# Altium project Pi Interface PCB.PrjPcb
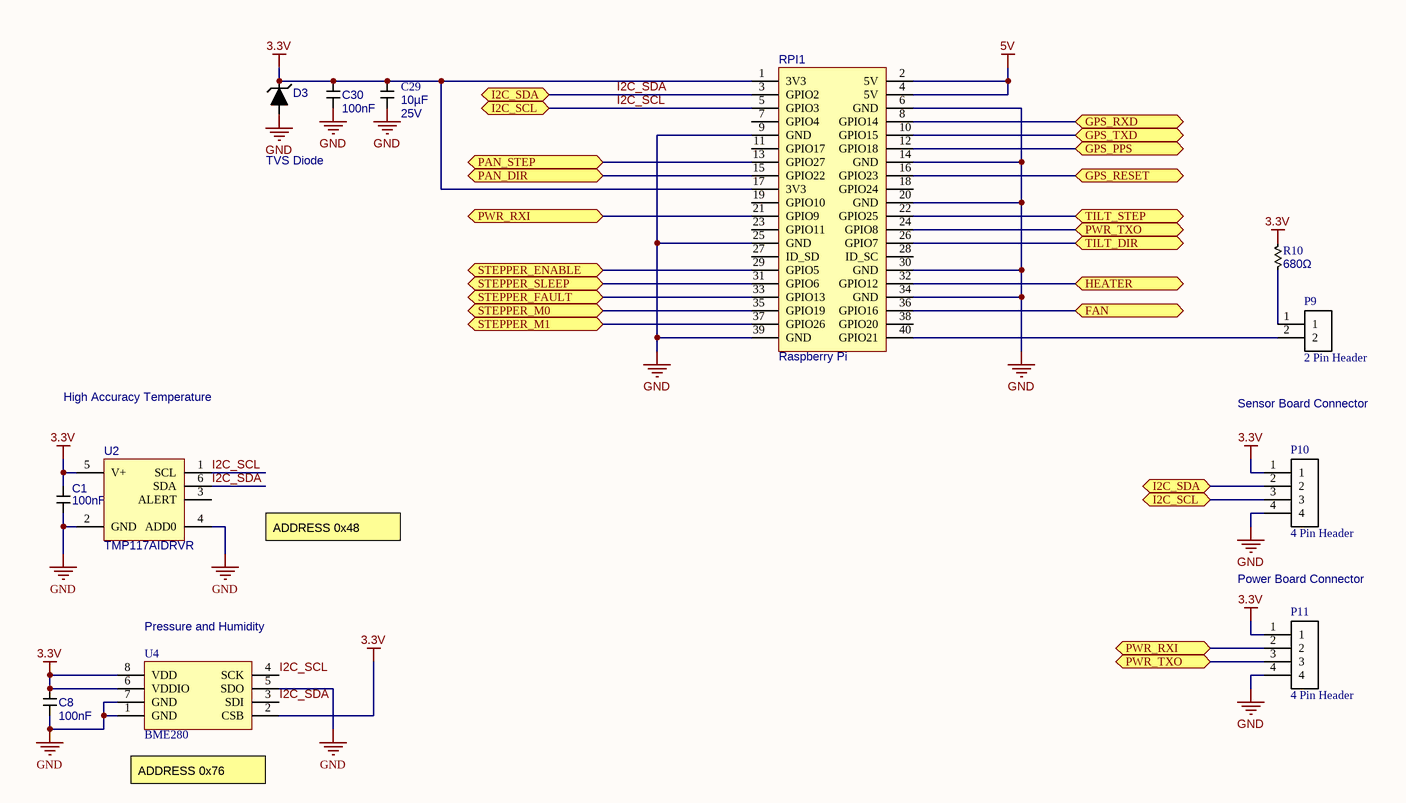
[diagram p0: Raspberry Pi Interface.SchDoc]
5 sheets, 73 parts. Net scope: flat (ports and power ports of the same name join across sheets).
Sheets:
  Raspberry Pi Interface.SchDoc
  Power Supply.SchDoc
  Electronics Heater.SchDoc
  GPS Receiver.SchDoc
  Pan & Tilt Stepper Control.SchDoc

## Sheet Raspberry Pi Interface.SchDoc
size A3

### Parts
(Parts that share a designator on the sheet are numbered #1, #2 ... from top to bottom, then left to right.)
?#1  (no value)
C1  100nF  [C0805]
C8  100nF  [C0805]
C29  Voltage Rating: 25V  Capacitance: 10µF  [C0805]  (hidden comment: F)
C30  100nF  [C0805]
D3  TVS Diode  [SP4020-01FTG-C]
P9  2 Pin Header  [S2B-XH-A(LF)(SN)]
P10  4 Pin Header  [B4B-XH-A]
P11  4 Pin Header  [B4B-XH-A]
R10  680Ω  [R0805]
RPI1  Raspberry Pi  [Raspberry Pi 4B]
U2  TMP117AIDRVR  [TMP117AIDRVR]
U4  BME280  [BME280]

### Ports
FAN, GPS_PPS, GPS_RESET, GPS_RXD, GPS_TXD, HEATER, I2C_SCL, I2C_SDA, PAN_DIR, PAN_STEP, PWR_RXI, PWR_TXO, STEPPER_ENABLE, STEPPER_FAULT, STEPPER_M0, STEPPER_M1, STEPPER_SLEEP, TILT_DIR, TILT_STEP

### Nets
3.3V: C1.1 C8.1 C29.1 C30.1 D3.1 P10.1 P11.1 R10.2 RPI1.1(3V3) RPI1.17(3V3) U2.5(V+) U4.2(CSB) U4.6(VDDIO) U4.8(VDD)
5V: RPI1.2(5V) RPI1.4(5V)
GND: C1.2 C8.2 C29.2 C30.2 D3.2 P10.4 P11.4 RPI1.6(GND) RPI1.9(GND) RPI1.14(GND) RPI1.20(GND) RPI1.25(GND) RPI1.30(GND) RPI1.34(GND) RPI1.39(GND) U2.2(GND) U2.4(ADD0) U4.1(GND) U4.5(SDO) U4.7(GND)
I2C_SCL: P10.3 RPI1.5(GPIO3) U2.1(SCL) U4.4(SCK) ; port I2C_SCL
I2C_SDA: P10.2 RPI1.3(GPIO2) U2.6(SDA) U4.3(SDI) ; port I2C_SDA
P-DIR: RPI1.15(GPIO22) ; port PAN_DIR
P-ENBL: RPI1.29(GPIO5) ; port STEPPER_ENABLE
P-STEP: RPI1.13(GPIO27) ; port PAN_STEP
NetGPS1_7: RPI1.12(GPIO18) ; port GPS_PPS
NetGPS1_13: RPI1.10(GPIO15) ; port GPS_TXD
NetGPS1_14: RPI1.8(GPIO14) ; port GPS_RXD
NetGPS1_18: RPI1.16(GPIO23) ; port GPS_RESET
NetP9_1: P9.1 R10.1
NetP9_2: P9.2 RPI1.40(GPIO21)
NetP11_2: P11.2 RPI1.21(GPIO9) ; port PWR_RXI
NetP11_3: P11.3 RPI1.24(GPIO8) ; port PWR_TXO
NetQ1_1: RPI1.32(GPIO12) ; port HEATER
NetQ2_1: RPI1.36(GPIO16) ; port FAN
NetRPI1_22: RPI1.22(GPIO25) ; port TILT_STEP
NetRPI1_26: RPI1.26(GPIO7) ; port TILT_DIR
NetRPI1_31: RPI1.31(GPIO6) ; port STEPPER_SLEEP
NetRPI1_33: RPI1.33(GPIO13) ; port STEPPER_FAULT
NetRPI1_35: RPI1.35(GPIO19) ; port STEPPER_M0
NetRPI1_37: RPI1.37(GPIO26) ; port STEPPER_M1

Not connected (* = marked no-connect by the designer): RPI1 7(GPIO4) 11(GPIO17) 18(GPIO24) 19(GPIO10) 23(GPIO11) 27(ID_SD) 28(ID_SC) 38(GPIO20); U2 3(ALERT)

### Notes on the sheet
- High Accuracy Temperature
- Sensor Board Connector
- ADDRESS 0x48
- Power Board Connector
- (near U4) Pressure and Humidity
- (near U4) ADDRESS 0x76
- DRAWN BY
- CHECKED BY
- DATE
- TITLE
- Title
- Size:
- Date:
- A3
- Number:
- Time:
- Revision:
- Sheet
- of
- APPROVED BY
- RELEASED BY
- SCALE:
- SIZE
- DRAWING NUMBER
- SHEET
- -
- OF
- File:

### Library data of the parts
?#1 = Title Block
C1 C8 C30 = Capacitor: Manufacturer: YAGEO; Manufacturer Part Number: CC0805KRX7R9BB104; Tolerance: ±10%; Temperature Coefficient: X7R; Voltage Rating: 50V; Supplier: Digi-Key Electronics; Supplier Part Number: 311-1140-1-ND; Capacitance: 100nF
C29 = Capacitor: Manufacturer: Samsung Electro-Mechanics; Manufacturer Part Number: CL21A106KAYNNNG; Supplier: Digi-Key Electronics; Supplier Part Number: 1276-6454-1-ND; Price: 0.28
D3 = Diode TVS: Manufacturer: Littelfuse Inc.; Supplier: Digi-Key Electronics; Supplier Part Number: F6271CT-ND; Manufacturer Part Number: SP4020-01FTG-C
P9 = Header 2: Manufacturer: JST Sales America Inc.; Manufacturer Part Number: S2B-XH-A; Supplier: Digi-Key Electronics; Supplier Part Number: 455-S2B-XH-A-ND
P10 P11 = Header 4: Manufacturer: JST; Manufacturer Part Number: B4B-XH-2; Supplier: Digi-Key Electronics; Supplier Part Number: 455-B4B-XH-A-ND
R10 = Resistor: Standard Resistor; Manufacturer: Panasonic Electronic Components; Manufacturer Part Number: ERJ-6GEYJ681V; Power Rating: 1/8W; Supplier: Digi-Key Electronics; Supplier Part Number: P680ACT-ND; Price: 0.16; Resistance: 680Ω
RPI1 = Raspberry Pi 40 Pin Header: Manufacturer Part Number: PPTC202LFBN-RC; Manufacturer: Sullins Connector Solutions; Current Rating: 3A; Supplier: Digi-Key Electronics; Supplier Part Number: S6104-ND; Price: $2.60; Operating Temperature: -40°C ~ 105°C
U2 = TMP117AIDRVR: Temperature Sensor Digital, Local -55°C ~ 150°C 16 b 6-WSON (2x2); Manufacturer: Texas Instruments; Manufacturer Part Number: TMP117AIDRVR; Supplier: Digi-Key Electronics; Supplier Part Number: 296-51834-1-ND
U4 = BME280: Pressure and Humidity Sensor; Manufacturer: Bosch Sensortec; Supplier: Digi-Key Electronics; Supplier Part Number: 828-1063-1-ND; Manufacturer Part Number: BME280

## Sheet Power Supply.SchDoc
size A3
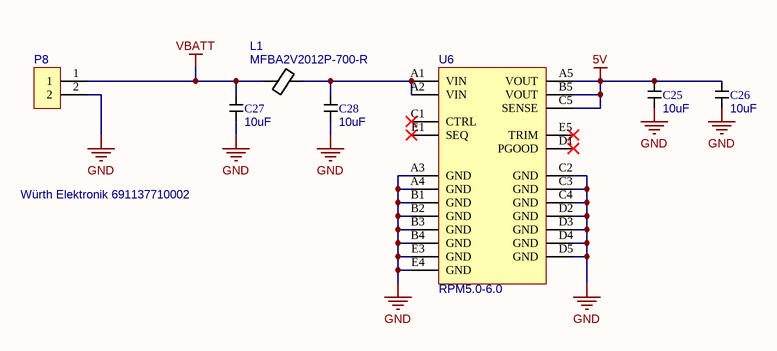
[diagram p1: Power Supply.SchDoc]

### Parts
(Parts that share a designator on the sheet are numbered #1, #2 ... from top to bottom, then left to right.)
?#2  (no value)
C25  Capacitance: 10uF  [C0805]  (hidden comment: F)
C26  Capacitance: 10uF  [C0805]  (hidden comment: F)
C27  Capacitance: 10uF  [C0805]  (hidden comment: F)
C28  Capacitance: 10uF  [C0805]  (hidden comment: F)
L1  MFBA2V2012P-700-R  [0805]
P8  Würth Elektronik 691137710002  [Würth Elektronik 691137710002]
U6  RPM5.0-6.0  [RPM5.0-6.0]

### Nets
5V: C25.1 C26.1 U6.A5(VOUT) U6.B5(VOUT) U6.C5(SENSE)
GND: C25.2 C26.2 C27.2 C28.2 P8.2 U6.A3(GND) U6.A4(GND) U6.B1(GND) U6.B2(GND) U6.B3(GND) U6.B4(GND) U6.C2(GND) U6.C3(GND) U6.C4(GND) U6.D2(GND) U6.D3(GND) U6.D4(GND) U6.D5(GND) U6.E3(GND) U6.E4(GND)
VBATT: C27.1 L1.1 P8.1
NetC28_1: C28.1 L1.2 U6.A1(VIN) U6.A2(VIN)

Not connected (* = marked no-connect by the designer): U6 C1(CTRL)* D1(PGOOD)* E1(SEQ)* E5(TRIM)*

### Notes on the sheet
- DRAWN BY
- CHECKED BY
- DATE
- TITLE
- Title
- Size:
- Date:
- A3
- Number:
- Time:
- Revision:
- Sheet
- of
- APPROVED BY
- RELEASED BY
- SCALE:
- SIZE
- DRAWING NUMBER
- SHEET
- -
- OF
- File:

### Library data of the parts
?#2 = Title Block
C25-C28 = Capacitor: Manufacturer: Murata Electronics; Manufacturer Part Number: GRM21BZ71E106KE15L; Voltage Rating: 25V; Supplier: Digi-Key Electronics; Supplier Part Number: 490-GRM21BZ71E106KE15LCT-ND; Price: 0.03
L1 = Ferrite Bead: Manufacturer: Eaton - Electronics Division; Impedance @ Frequency: 70 Ohms @ 100 MHz; Current Rating: 6A; Supplier: Digi-Key Electronics; Supplier Part Number: 283-MFBA2V2012P-700-RCT-ND; Manufacturer Part Number: MFBA2V2012P-700-R
P8 = Würth Elektronik 691137710002: 2 Position Wire to Board Terminal Block Horizontal with Board 0.197" (5.00mm) Through Hole; Positions: 2; Voltage Rating: 300V; Current Rating: 16A; Wire Gauge: 12-30AWG; Manufacturer: Würth Elektronik; Manufacturer Part Number: 691137710002; Supplier: Digi-Key Electronics; Supplier Part Number: 732-10955-ND
U6 = RPM5.0-6.0: Non-Isolated PoL Module DC DC Converter 1 Output 5V 6A 4V - 15V Input; Manufacturer: Recom Power; Voltage Input: 4 - 15V; Supplier: Digi-Key Electronics; Supplier Part Number: 945-RPM5.0-6.0CT-ND; Manufacturer Part Number: RPM5.0-6.0; Output Voltage: 5V; Output Current: 6A

## Sheet Electronics Heater.SchDoc
size A3
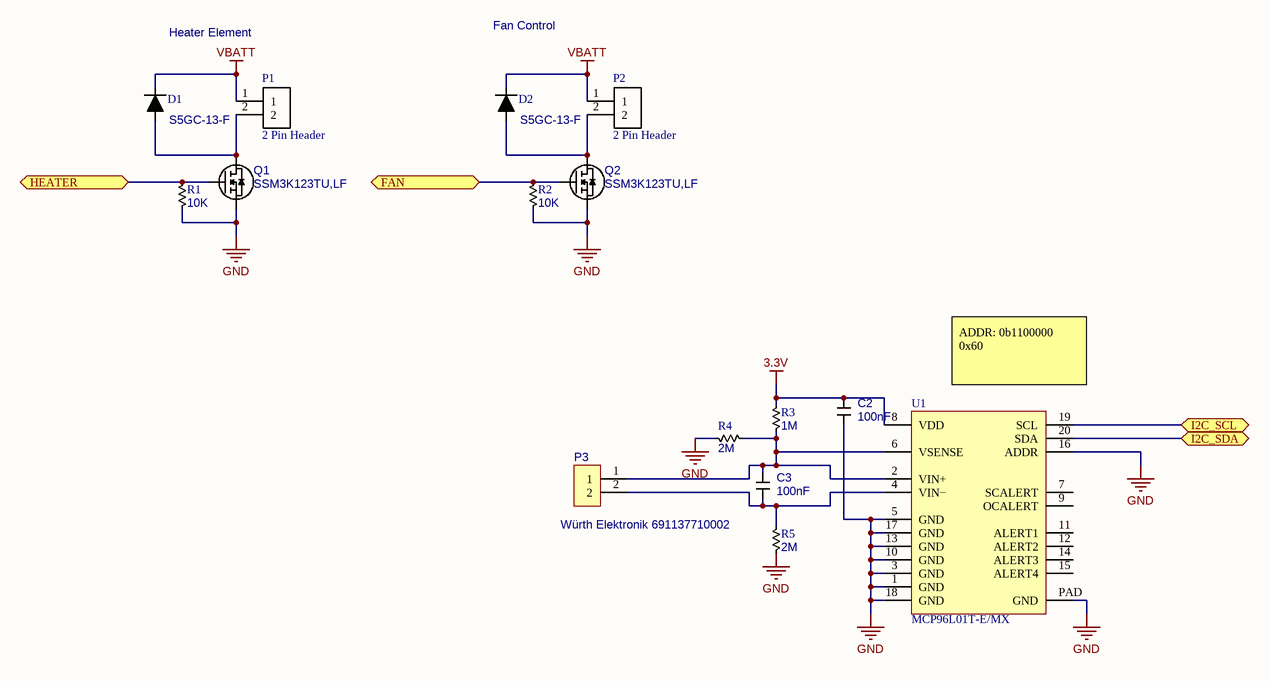
[diagram p2: Electronics Heater.SchDoc]

### Parts
(Parts that share a designator on the sheet are numbered #1, #2 ... from top to bottom, then left to right.)
?#3  (no value)
C2  100nF  [C0805]
C3  100nF  [C0805]
D1  S5GC-13-F  [SMC]
D2  S5GC-13-F  [SMC]
P1  2 Pin Header  [S2B-XH-A(LF)(SN)]
P2  2 Pin Header  [S2B-XH-A(LF)(SN)]
P3  Würth Elektronik 691137710002  [Würth Elektronik 691137710002]
Q1  SSM3K123TU,LF  [SSM3K123TU,LF]
Q2  SSM3K123TU,LF  [SSM3K123TU,LF]
R1  Resistance: 10K  [R0805]  (hidden comment: 330Ω)
R2  Resistance: 10K  [R0805]  (hidden comment: 330Ω)
R3  Resistance: 1M  [R0805]  (hidden comment: 330Ω)
R4  Resistance: 2M  [R0805]  (hidden comment: 330Ω)
R5  Resistance: 2M  [R0805]  (hidden comment: 330Ω)
U1  MCP96L01T-E/MX  [MCP96L01T-E/MX]

### Ports
FAN, HEATER, I2C_SCL, I2C_SDA

### Nets
3.3V: C2.1 R3.2 U1.8(VDD)
GND: C2.2 Q1.2 Q2.2 R1.1 R2.1 R4.2 R5.2 U1.1(GND) U1.3(GND) U1.5(GND) U1.10(GND) U1.13(GND) U1.16(ADDR) U1.17(GND) U1.18(GND) U1.PAD(GND)
VBATT: D1.1 D2.1 P1.1 P2.1
I2C_SCL: U1.19(SCL) ; port I2C_SCL
I2C_SDA: U1.20(SDA) ; port I2C_SDA
NetC3_1: C3.1 P3.1 R3.1 R4.1 U1.2(VIN+) U1.6(VSENSE)
NetC3_2: C3.2 P3.2 R5.1 U1.4(VIN−)
NetD1_2: D1.2 P1.2 Q1.3
NetD2_2: D2.2 P2.2 Q2.3
NetQ1_1: Q1.1 R1.2 ; port HEATER
NetQ2_1: Q2.1 R2.2 ; port FAN

Not connected (* = marked no-connect by the designer): U1 7(SCALERT) 9(OCALERT) 11(ALERT1) 12(ALERT2) 14(ALERT3) 15(ALERT4)

### Notes on the sheet
- Heater Element
- Fan Control
- (near U1) ADDR: 0b1100000
  0x60
- DRAWN BY
- CHECKED BY
- DATE
- TITLE
- Title
- Size:
- Date:
- A3
- Number:
- Time:
- Revision:
- Sheet
- of
- APPROVED BY
- RELEASED BY
- SCALE:
- SIZE
- DRAWING NUMBER
- SHEET
- -
- OF
- File:

### Library data of the parts
?#3 = Title Block
C2 C3 = Capacitor: as C1 on sheet Raspberry Pi Interface; Supplier: Digi-Key Electronics; Supplier Part Number: 311-1140-1-ND; Capacitance: 100nF
D1 D2 = Diode: Manufacturer: Diodes Incorporated; Current Rating: 5A; Voltage: 400V; Supplier: Digi-Key Electronics; Supplier Part Number: S5GC-FDICT-ND; Manufacturer Part Number: S5GC-13-F
P1 P2 = Header 2: as P9 on sheet Raspberry Pi Interface; Supplier: Digi-Key Electronics; Supplier Part Number: 455-S2B-XH-A-ND
P3 = Würth Elektronik 691137710002: as P8 on sheet Power Supply; Manufacturer: Würth Elektronik; Manufacturer Part Number: 691137710002; Supplier: Digi-Key Electronics; Supplier Part Number: 732-10955-ND
Q1 Q2 = SSM3K123TU,LF: N-Channel 20 V 4.2A (Ta) 500mW (Ta) Surface Mount UFM; Manufacturer: Toshiba Semiconductor and Storage; Supplier: Digi-Key Electronics; Supplier Part Number: SSM3K123TULFCT-ND; Manufacturer Part Number: SSM3K123TU,LF
R1 R2 = Resistor: Standard Resistor; Manufacturer: YAGEO; Manufacturer Part Number: RC0805JR-0710KL; Power Rating: 1/8W; Supplier: Digi-Key Electronics; Supplier Part Number: 311-10KARCT-ND; Price: 0.16
R3 = Resistor: Standard Resistor; Manufacturer: Panasonic Electronic Components; Manufacturer Part Number: ERA-6AEB105V; Power Rating: 1/8W; Supplier: Digi-Key Electronics; Supplier Part Number: P1MDACT-ND; Price: 0.16
R4 R5 = Resistor: Standard Resistor; Manufacturer: Vishay Dale; Manufacturer Part Number: CRCW08052M00FKECC; Power Rating: 1/8W; Supplier: Digi-Key Electronics; Supplier Part Number: 541-4129-1-ND; Price: 0.16
U1 = MCP96L01T-E/MX: Thermocouple EMF to Temperature Converter,  ±1.5°C Maximum Accuracy; Manufacturer: Microchip Technology; Supplier: Digi-Key Electronics; Manufacturer Part Number: MCP96L01T-E/MX; Supplier Part Number: 150-MCP96L01T-E/MXCT-ND

## Sheet GPS Receiver.SchDoc
size A3
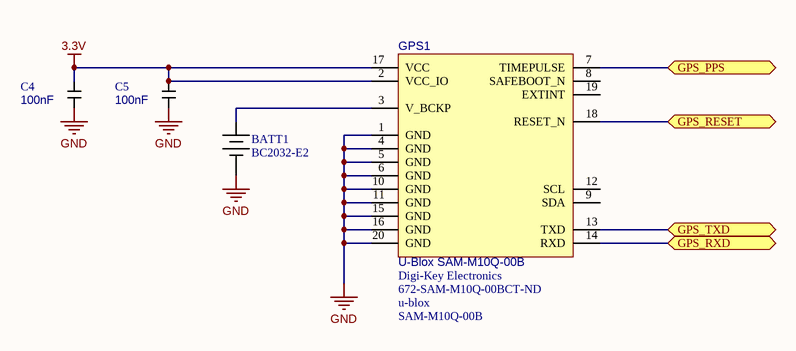
[diagram p3: GPS Receiver.SchDoc]

### Parts
(Parts that share a designator on the sheet are numbered #1, #2 ... from top to bottom, then left to right.)
?#4  (no value)
BATT1  BC2032-E2  [BC2032-E2]
C4  Capacitance: 100nF  [C0805]  (hidden comment: F)
C5  Capacitance: 100nF  [C0805]  (hidden comment: F)
GPS1  U-Blox SAM-M10Q-00B  Supplier: Digi-Key Electronics  Supplier Part Number: 672-SAM-M10Q-00BCT-ND  Manufacturer: u-blox  Manufacturer Part Number: SAM-M10Q-00B  [U-BLOX SAM-M10Q-00B]

### Ports
GPS_PPS, GPS_RESET, GPS_RXD, GPS_TXD

### Nets
3.3V: C4.1 C5.1 GPS1.2(VCC_IO) GPS1.17(VCC)
GND: BATT1.2 C4.2 C5.2 GPS1.1(GND) GPS1.4(GND) GPS1.5(GND) GPS1.6(GND) GPS1.10(GND) GPS1.11(GND) GPS1.15(GND) GPS1.16(GND) GPS1.20(GND)
NetBATT1_1: BATT1.1 GPS1.3(V_BCKP)
NetGPS1_7: GPS1.7(TIMEPULSE) ; port GPS_PPS
NetGPS1_13: GPS1.13(TXD) ; port GPS_TXD
NetGPS1_14: GPS1.14(RXD) ; port GPS_RXD
NetGPS1_18: GPS1.18(RESET_N) ; port GPS_RESET

Not connected (* = marked no-connect by the designer): GPS1 8(SAFEBOOT_N) 9(SDA) 12(SCL) 19(EXTINT)

### Notes on the sheet
- DRAWN BY
- CHECKED BY
- DATE
- TITLE
- Title
- Size:
- Date:
- A3
- Number:
- Time:
- Revision:
- Sheet
- of
- APPROVED BY
- RELEASED BY
- SCALE:
- SIZE
- DRAWING NUMBER
- SHEET
- -
- OF
- File:

### Library data of the parts
?#4 = Title Block
BATT1 = BC2032-E2: Battery; Manufacturer: MPD (Memory Protection Devices); Manufacturer Part Number: BC2032-E2; Supplier Part Number: BC2032-E2-ND; Supplier: Digi-Key Electronics
C4 C5 = Capacitor: Manufacturer: Samsung Electro-Mechanics; Manufacturer Part Number: CL21B104KBCNNNC; Voltage Rating: 50V; Supplier: Digi-Key Electronics; Supplier Part Number: 1276-1003-1-ND; Price: 0.16
GPS1 = U-Blox SAM-M10Q-00B: GPS with integrated Antenna

## Sheet Pan & Tilt Stepper Control.SchDoc
size A3
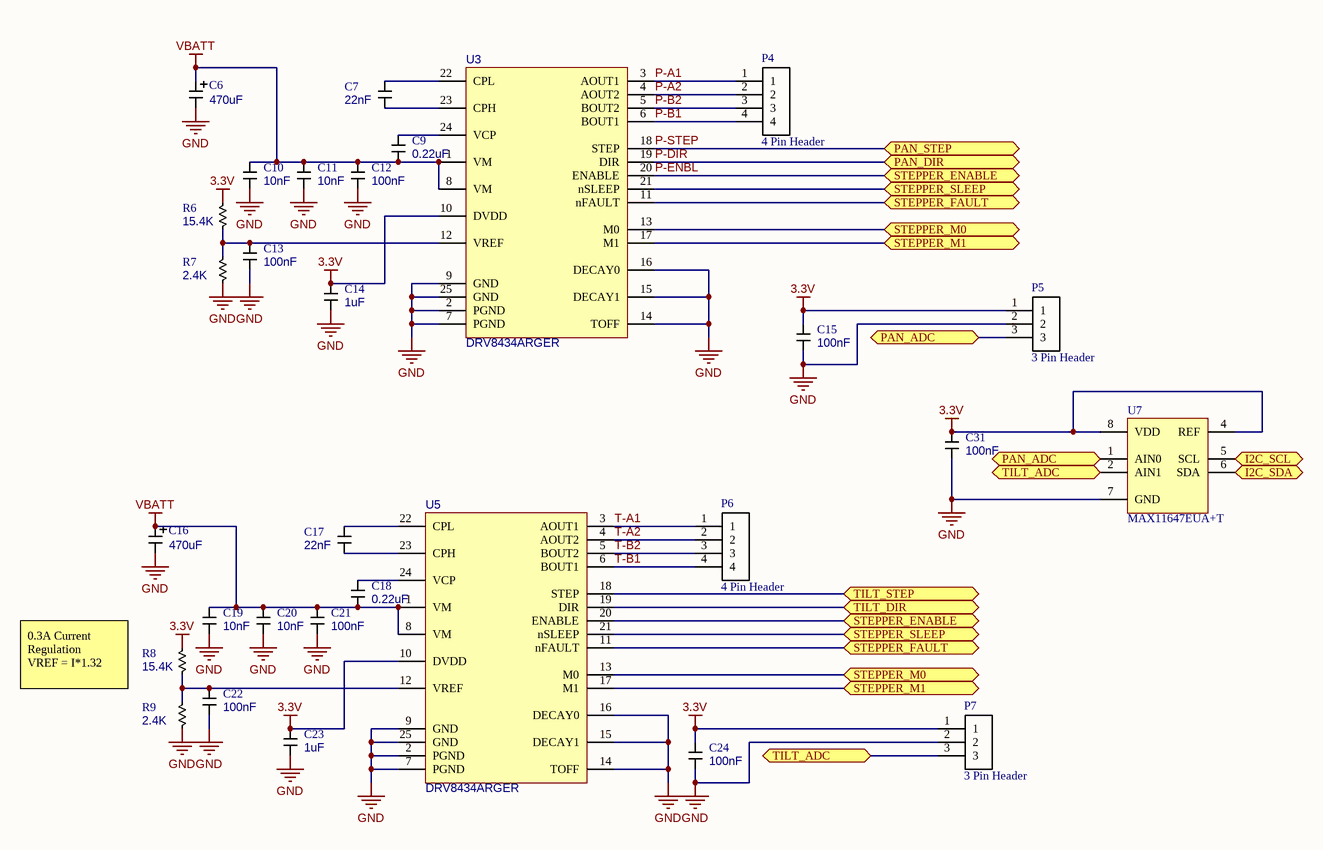
[diagram p4: Pan & Tilt Stepper Control.SchDoc]

### Parts
(Parts that share a designator on the sheet are numbered #1, #2 ... from top to bottom, then left to right.)
?#5  (no value)
C6  Capacitance: 470uF  [Panasonic EEE-FT1E471AP]  (hidden comment: F)
C7  Capacitance: 22nF  [C0805]  (hidden comment: F)
C9  Capacitance: 0.22uF  [C0805]  (hidden comment: F)
C10  Capacitance: 10nF  [C0805]  (hidden comment: F)
C11  Capacitance: 10nF  [C0805]  (hidden comment: F)
C12  Capacitance: 100nF  [C0805]  (hidden comment: F)
C13  Capacitance: 100nF  [C0805]  (hidden comment: F)
C14  Capacitance: 1uF  [C0805]  (hidden comment: F)
C15  Capacitance: 100nF  [C0805]  (hidden comment: F)
C16  Capacitance: 470uF  [Panasonic EEE-FT1E471AP]  (hidden comment: F)
C17  Capacitance: 22nF  [C0805]  (hidden comment: F)
C18  Capacitance: 0.22uF  [C0805]  (hidden comment: F)
C19  Capacitance: 10nF  [C0805]  (hidden comment: F)
C20  Capacitance: 10nF  [C0805]  (hidden comment: F)
C21  Capacitance: 100nF  [C0805]  (hidden comment: F)
C22  Capacitance: 100nF  [C0805]  (hidden comment: F)
C23  Capacitance: 1uF  [C0805]  (hidden comment: F)
C24  Capacitance: 100nF  [C0805]  (hidden comment: F)
C31  Capacitance: 100nF  [C0805]  (hidden comment: F)
P4  4 Pin Header  [B4B-XH-A]
P5  3 Pin Header  [B3B-XH-A]
P6  4 Pin Header  [B4B-XH-A]
P7  3 Pin Header  [B3B-XH-A]
R6  Resistance: 15.4K  [R0805]  (hidden comment: 330Ω)
R7  Resistance: 2.4K  [R0805]  (hidden comment: 330Ω)
R8  Resistance: 15.4K  [R0805]  (hidden comment: 330Ω)
R9  Resistance: 2.4K  [R0805]  (hidden comment: 330Ω)
U3  DRV8434ARGER  [DRV8434ARGER]
U5  DRV8434ARGER  [DRV8434ARGER]
U7  MAX11647EUA+T  [MAX11647EUA+T]

### Ports
I2C_SCL, I2C_SDA, PAN_ADC, PAN_DIR, PAN_STEP, STEPPER_ENABLE, STEPPER_FAULT, STEPPER_M0, STEPPER_M1, STEPPER_SLEEP, TILT_ADC, TILT_DIR, TILT_STEP

### Nets
3.3V: C14.1 C15.1 C23.1 C24.1 C31.1 P5.1 P7.1 R6.2 R8.2 U3.10(DVDD) U5.10(DVDD) U7.4(REF) U7.8(VDD)
GND: C6.2 C10.2 C11.2 C12.2 C13.2 C14.2 C15.2 C16.2 C19.2 C20.2 C21.2 C22.2 C23.2 C24.2 C31.2 P5.2 P7.2 R7.1 R9.1 U3.2(PGND) U3.7(PGND) U3.9(GND) U3.14(TOFF) U3.15(DECAY1) U3.16(DECAY0) U3.25(GND) U5.2(PGND) U5.7(PGND) U5.9(GND) U5.14(TOFF) U5.15(DECAY1) U5.16(DECAY0) U5.25(GND) U7.7(GND)
VBATT: C6.1 C9.2 C10.1 C11.1 C12.1 C16.1 C18.2 C19.1 C20.1 C21.1 U3.1(VM) U3.8(VM) U5.1(VM) U5.8(VM)
I2C_SCL: U7.5(SCL) ; port I2C_SCL
I2C_SDA: U7.6(SDA) ; port I2C_SDA
P-A1: P4.1 U3.3(AOUT1)
P-A2: P4.2 U3.4(AOUT2)
P-B1: P4.4 U3.6(BOUT1)
P-B2: P4.3 U3.5(BOUT2)
P-DIR: U3.19(DIR) ; port PAN_DIR
P-ENBL: U3.20(ENABLE) U5.20(ENABLE) ; port STEPPER_ENABLE
P-STEP: U3.18(STEP) ; port PAN_STEP
T-A1: P6.1 U5.3(AOUT1)
T-A2: P6.2 U5.4(AOUT2)
T-B1: P6.4 U5.6(BOUT1)
T-B2: P6.3 U5.5(BOUT2)
NetC7_1: C7.1 U3.22(CPL)
NetC7_2: C7.2 U3.23(CPH)
NetC9_1: C9.1 U3.24(VCP)
NetC13_1: C13.1 R6.1 R7.2 U3.12(VREF)
NetC17_1: C17.1 U5.22(CPL)
NetC17_2: C17.2 U5.23(CPH)
NetC18_1: C18.1 U5.24(VCP)
NetC22_1: C22.1 R8.1 R9.2 U5.12(VREF)
NetP5_3: P5.3 U7.1(AIN0) ; port PAN_ADC
NetP7_3: P7.3 U7.2(AIN1) ; port TILT_ADC
NetRPI1_22: U5.18(STEP) ; port TILT_STEP
NetRPI1_26: U5.19(DIR) ; port TILT_DIR
NetRPI1_31: U3.21(nSLEEP) U5.21(nSLEEP) ; port STEPPER_SLEEP
NetRPI1_33: U3.11(nFAULT) U5.11(nFAULT) ; port STEPPER_FAULT
NetRPI1_35: U3.13(M0) U5.13(M0) ; port STEPPER_M0
NetRPI1_37: U3.17(M1) U5.17(M1) ; port STEPPER_M1

### Notes on the sheet
- 0.3A Current Regulation
  VREF = I*1.32
- DRAWN BY
- CHECKED BY
- DATE
- TITLE
- Title
- Size:
- Date:
- A3
- Number:
- Time:
- Revision:
- Sheet
- of
- APPROVED BY
- RELEASED BY
- SCALE:
- SIZE
- DRAWING NUMBER
- SHEET
- -
- OF
- File:

### Library data of the parts
?#5 = Title Block
C6 C16 = Capacitor Polarized: Polarized Capacitor; Manufacturer: Panasonic Electronic Components; Manufacturer Part Number: EEE-FT1E471AP; Voltage Rating: 25V; Supplier: Digi-Key Electronics; Supplier Part Number: PCE5010CT-ND
C7 C17 = Capacitor: Manufacturer: TDK Corporation; Manufacturer Part Number: CGA4J3X7R2E223K125AA; Voltage Rating: 250V; Supplier: Digi-Key Electronics; Supplier Part Number: 445-5836-1-ND; Price: 0.16
C9 C18 = Capacitor: Manufacturer: KEMET; Manufacturer Part Number: C0805C224K5RAC7800; Voltage Rating: 50V; Supplier: Digi-Key Electronics; Supplier Part Number: 399-C0805C224K5RACTUCT-ND; Price: 0.24
C10 C11 C19 C20 = Capacitor: Manufacturer: YAGEO; Manufacturer Part Number: CC0805KRX7R9BB103; Voltage Rating: 50V; Supplier: Digi-Key Electronics; Supplier Part Number: 311-1136-1-ND; Price: 0.16
C12 C13 C15 C21 C22 C24 C31 = Capacitor: as C4 on sheet GPS Receiver; Supplier: Digi-Key Electronics; Supplier Part Number: 1276-1003-1-ND; Price: 0.16
C14 C23 = Capacitor: Manufacturer: Samsung Electro-Mechanics; Manufacturer Part Number: CL21B105KAFNNNE; Voltage Rating: 25V; Supplier: Digi-Key Electronics; Supplier Part Number: 1276-1066-1-ND; Price: 0.16
P4 P6 = Header 4: as P10 on sheet Raspberry Pi Interface; Supplier: Digi-Key Electronics; Supplier Part Number: 455-B4B-XH-A-ND
P5 P7 = Header 3: Manufacturer: JST Sales America Inc.; Supplier: Digi-Key Electronics; Supplier Part Number: 455-2248-ND; Manufacturer Part Number: B3B-XH-A
R6 R8 = Resistor: Standard Resistor; Manufacturer: Vishay Dale; Manufacturer Part Number: CRCW080515K4FKEA; Power Rating: 1/8W; Supplier: Digi-Key Electronics; Supplier Part Number: 541-15.4KCCT-ND; Price: 0.16
R7 R9 = Resistor: Standard Resistor; Manufacturer: Vishay Dale; Manufacturer Part Number: CRCW08052K10FKEA; Power Rating: 1/8W; Supplier: Digi-Key Electronics; Supplier Part Number: 541-2.10KCCT-ND; Price: 0.16
U3 U5 = DRV8434ARGER: Bipolar Motor Driver NMOS Step/Direction 24-VQFN (4x4); Manufacturer: Texas Instruments; Supplier: Digi-Key Electronics; Supplier Part Number: 296-DRV8434ARGERCT-ND; Manufacturer Part Number: DRV8434ARGER
U7 = MAX11647EUA+T: 10 Bit Analog to Digital Converter 1, 2 Input 1 SAR 8-uMAX/uSOP; Manufacturer: Analog Devices Inc./Maxim Integrated; Supplier: Digi-Key Electronics; Supplier Part Number: 175-MAX11647EUA+TCT-ND; Manufacturer Part Number: MAX11647EUA+T

## Nets that join several sheets
3.3V: Raspberry Pi Interface (14 pins), Electronics Heater (C2.1 R3.2 U1.8), GPS Receiver (C4.1 C5.1 GPS1.2 GPS1.17), Pan & Tilt Stepper Control (13 pins)
5V: Raspberry Pi Interface (RPI1.2 RPI1.4), Power Supply (5 pins)
GND: Raspberry Pi Interface (20 pins), Power Supply (20 pins), Electronics Heater (16 pins), GPS Receiver (12 pins), Pan & Tilt Stepper Control (34 pins)
VBATT: Power Supply (C27.1 L1.1 P8.1), Electronics Heater (D1.1 D2.1 P1.1 P2.1), Pan & Tilt Stepper Control (14 pins)
I2C_SCL: Raspberry Pi Interface (P10.3 RPI1.5 U2.1 U4.4), Electronics Heater (U1.19), Pan & Tilt Stepper Control (U7.5)
I2C_SDA: Raspberry Pi Interface (P10.2 RPI1.3 U2.6 U4.3), Electronics Heater (U1.20), Pan & Tilt Stepper Control (U7.6)
NetGPS1_7: Raspberry Pi Interface (RPI1.12), GPS Receiver (GPS1.7)
NetGPS1_13: Raspberry Pi Interface (RPI1.10), GPS Receiver (GPS1.13)
NetGPS1_14: Raspberry Pi Interface (RPI1.8), GPS Receiver (GPS1.14)
NetGPS1_18: Raspberry Pi Interface (RPI1.16), GPS Receiver (GPS1.18)
NetQ1_1: Raspberry Pi Interface (RPI1.32), Electronics Heater (Q1.1 R1.2)
NetQ2_1: Raspberry Pi Interface (RPI1.36), Electronics Heater (Q2.1 R2.2)
NetRPI1_22: Raspberry Pi Interface (RPI1.22), Pan & Tilt Stepper Control (U5.18)
NetRPI1_26: Raspberry Pi Interface (RPI1.26), Pan & Tilt Stepper Control (U5.19)
NetRPI1_31: Raspberry Pi Interface (RPI1.31), Pan & Tilt Stepper Control (U3.21 U5.21)
NetRPI1_33: Raspberry Pi Interface (RPI1.33), Pan & Tilt Stepper Control (U3.11 U5.11)
NetRPI1_35: Raspberry Pi Interface (RPI1.35), Pan & Tilt Stepper Control (U3.13 U5.13)
NetRPI1_37: Raspberry Pi Interface (RPI1.37), Pan & Tilt Stepper Control (U3.17 U5.17)
P-DIR: Raspberry Pi Interface (RPI1.15), Pan & Tilt Stepper Control (U3.19)
P-ENBL: Raspberry Pi Interface (RPI1.29), Pan & Tilt Stepper Control (U3.20 U5.20)
P-STEP: Raspberry Pi Interface (RPI1.13), Pan & Tilt Stepper Control (U3.18)